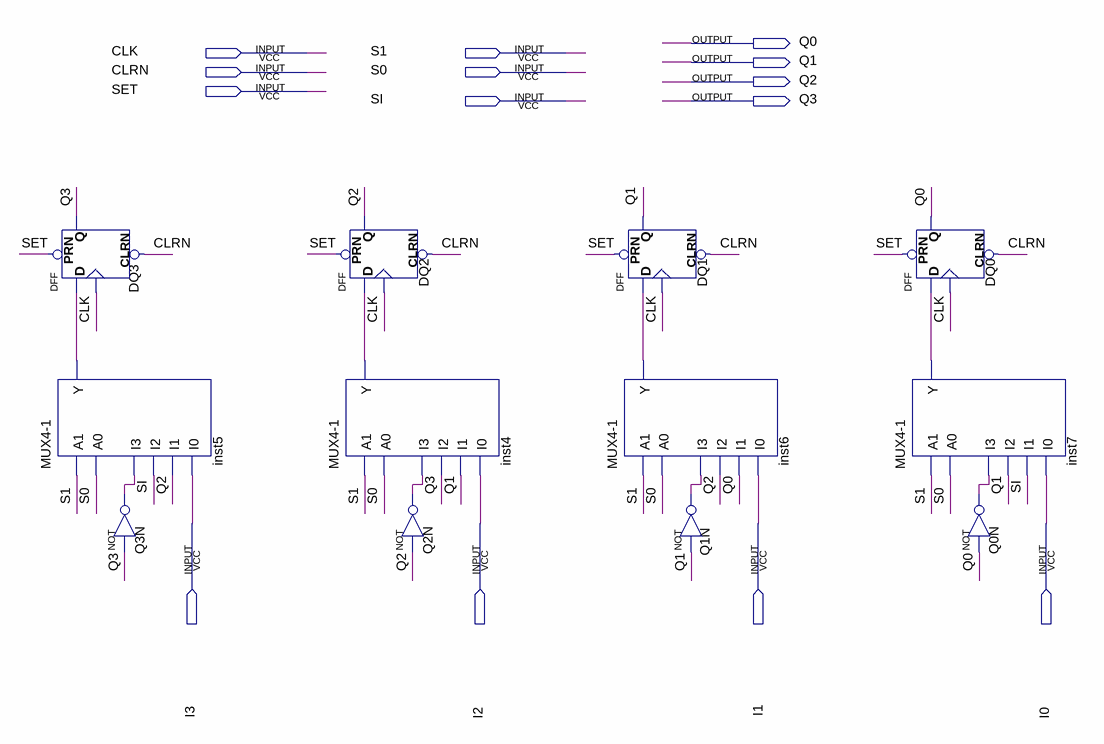
[diagram p0: schematic sheet]
// Quartus schematic Question7.bdf as structural Verilog: 12 symbols, 14 pins
module Question7 (
  input  CLK,
  input  S1,
  input  CLRN,
  input  S0,
  input  SET,
  input  SI,
  input  I3,
  input  I2,
  input  I1,
  input  I0,
  output Q0,
  output Q1,
  output Q2,
  output Q3
);

  wire inst4_y, inst5_y, inst6_y, inst7_y, Q0N_out, Q1N_out, Q2N_out, Q3N_out;

  DFF DQ3 (.CLRN(CLRN), .CLK(CLK), .D(inst5_y), .PRN(SET), .Q(Q3));
  \MUX4-1  inst5 (.A1(S1), .A0(S0), .I3(Q3N_out), .I2(SI), .I1(Q2), .I0(I3), .Y(inst5_y));
  not Q3N (Q3N_out, Q3);
  \MUX4-1  inst4 (.A1(S1), .A0(S0), .I3(Q2N_out), .I2(Q3), .I1(Q1), .I0(I2), .Y(inst4_y));
  DFF DQ2 (.CLRN(CLRN), .CLK(CLK), .D(inst4_y), .PRN(SET), .Q(Q2));
  not Q2N (Q2N_out, Q2);
  DFF DQ1 (.CLRN(CLRN), .CLK(CLK), .D(inst6_y), .PRN(SET), .Q(Q1));
  \MUX4-1  inst6 (.A1(S1), .A0(S0), .I3(Q1N_out), .I2(Q2), .I1(Q0), .I0(I1), .Y(inst6_y));
  not Q1N (Q1N_out, Q1);
  DFF DQ0 (.CLRN(CLRN), .CLK(CLK), .D(inst7_y), .PRN(SET), .Q(Q0));
  \MUX4-1  inst7 (.A1(S1), .A0(S0), .I3(Q0N_out), .I2(Q1), .I1(SI), .I0(I0), .Y(inst7_y));
  not Q0N (Q0N_out, Q0);
endmodule
